# Altium schematic sheet Sheet2.SchDoc
size A
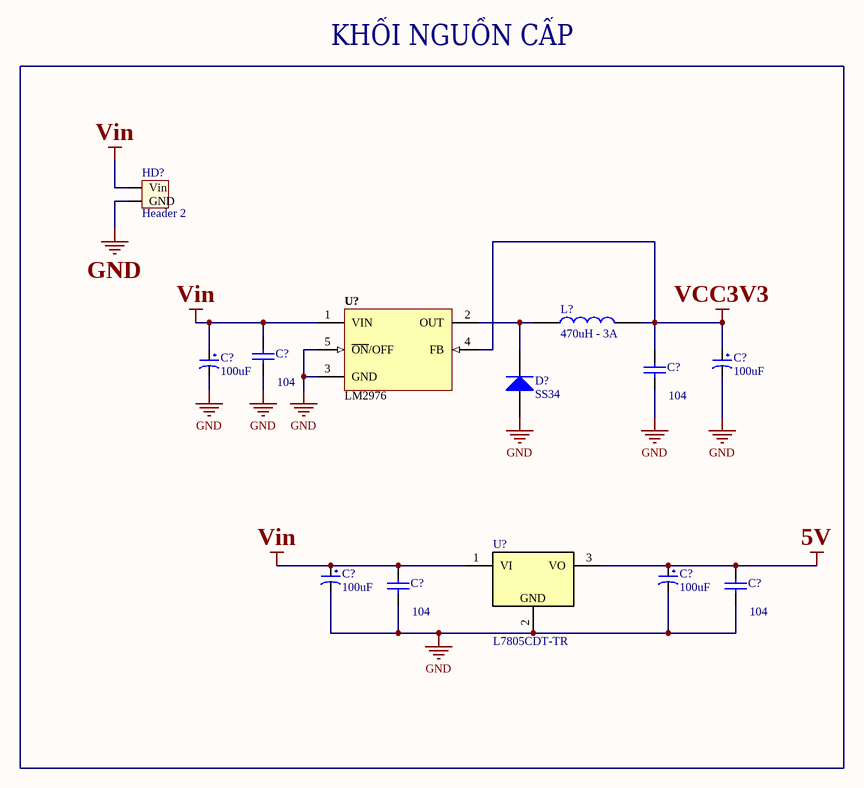
[diagram p0: Sheet2.SchDoc]

## Parts
(Parts that share a designator on the sheet are numbered #1, #2 ... from top to bottom, then left to right.)
C?#1  104  [tu 0805]
C?#2  100uF  [tu hoa 8mm]
C?#3  100uF  [tu hoa 8mm]
C?#4  104  [tu 0805]
C?#5  100uF  [tu hoa 8mm]
C?#6  100uF  [tu hoa 8mm]
C?#7  104  [tu 0805]
C?#8  104  [tu 0805]
D?  SS34  [DIODE SMA]
HD?  Header 2  [HED2]
L?  470uH - 3A  [CUON CAM 100uH3A]
U?#1  LM2976  [TO263]
U?#2  L7805CDT-TR  [DPAK_118_446_112X59_SMD]

## Nets
5V: C?#6.1 C?#8.1 U?#2.3(VO)
GND: C?#1.2 C?#2.2 C?#3.2 C?#4.2 C?#5.2 C?#6.2 C?#7.2 C?#8.2 D?.1(A) HD?.2(GND) U?#1.3(GND) U?#1.5(~{ON}/OFF) U?#2.2
VCC3V3: C?#3.1 C?#4.1 L?.2 U?#1.4(FB)
Vin: C?#1.1 C?#2.1 C?#5.1 C?#7.1 HD?.1(Vin) U?#1.1(VIN) U?#2.1(VI)
NetD?_2: D?.2(K) L?.1 U?#1.2(OUT)

## Notes on the sheet
- KHỐI NGUỒN CẤP
- (in symbol REG_35V_5V-1.5A-7.5W-DPAK) GND

## Library data of the parts
C?#1 C?#4 C?#7 C?#8 = Tu 0805 104 50V 10%: Dán; Don_Vi: Con; So_Chan: 2; Ten_Linh_Kien: Tụ 0805 104-100nF 10% 50V; Ma_Hang: MH004551; Chung_Loai: Dán; Kieu_Chan: *
C?#2 C?#3 C?#5 C?#6 = Tu Hoa 100uF 50V 8x11: Cắm; Don_Vi: Con; So_Chan: 2; Ten_Linh_Kien: Tụ Hóa 100uF 50V 8x11MM; Ma_Hang: MH006872; Chung_Loai: Cắm; Kieu_Chan: *
D? = Diode SS34 ( 1N5822 ): Dán; Don_Vi: Con; Ma_Hang: MH002104; Ten_Linh_Kien: Diode SS34 3A 40V SMA ( 1N5822 SS34A); Kieu_Chan: *; Chung_Loai: Dán
HD? = Hed2: Header 2 (Green); Value: Header 2
L? = CUON CAM 470uH DIP: Cắm; Don_Vi: Con; Ma_Hang: MH002232; Ten_Linh_Kien: Cuộn Cảm 470uH 3A 8x10MM; Ghi_Chu: *; Kieu_Chan: *; Chung_Loai: Cắm
U?#1 = LM2596: Max Input Voltage: 12 V; Max Output Current: 3 (6.0 peak) A; Max Output Voltage: mV; Category: IC-Power; Min Input Voltage: mV; Min Output Voltage: mV; Mounting Technology: Surface Mount; Status: Unreleased; Supply Voltage: mV; Temperature Range: -40 to +125 degC
U?#2 = REG_35V_5V-1.5A-7.5W-DPAK: Linear Voltage Regulator IC 1 Output 1.5A DPAK; Manufacturer: Diodes; Alternate Part Number-1: CJ7805 3%; Manufacturer Part Number: L7805CDT-TR; Case/Package: DPAK; Supplier-1: SP ROAD; Supplier Part Number-1: L7805CDT-TR